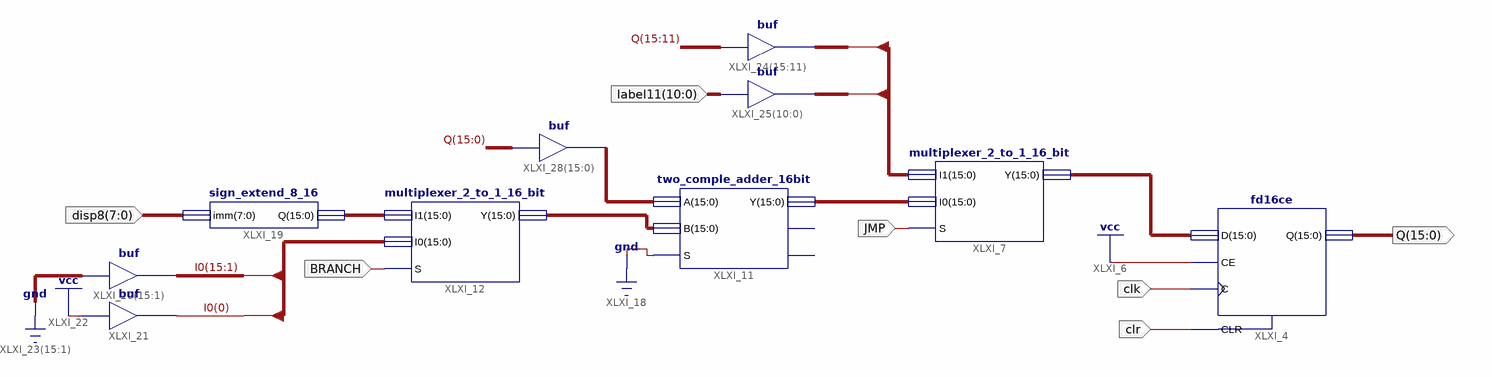
[diagram p0: schematic sheet 1]
// Xilinx ISE schematic PC_circuitry.sch (virtex6) as structural Verilog: 10 symbols, 7 ports
module PC_circuitry (
  input  clk,
  input  clr,
  input  JMP,
  input  BRANCH,
  input  [7:0] disp8,
  input  [10:0] label11,
  output [15:0] Q
);

  wire [15:0] I0, I1, XLXN_4, XLXN_12, XLXN_22, XLXN_23, XLXN_67;

  fd16ce XLXI_4 (.C(clk), .CE(1'b1), .CLR(clr), .D(XLXN_4), .Q(Q));
  multiplexer_2_to_1_16_bit XLXI_7 (.I0(XLXN_12), .I1(I1), .S(JMP), .Y(XLXN_4));
  two_comple_adder_16bit XLXI_11 (.A(XLXN_67), .B(XLXN_22), .S(1'b0), .Y(XLXN_12));  // open: Cout, Cout_1
  multiplexer_2_to_1_16_bit XLXI_12 (.I0(I0), .I1(XLXN_23), .S(BRANCH), .Y(XLXN_22));
  sign_extend_8_16 XLXI_19 (.imm(disp8), .Q(XLXN_23));
  assign I0[15:1] = {15{1'b0}};  // buf XLXI_20[15..1], 15 bits wide
  buf XLXI_21 (I0[0], 1'b1);
  assign I1[15:11] = Q[15:11];  // buf XLXI_24[15..11], 5 bits wide
  assign I1[10:0] = label11;  // buf XLXI_25[10..0], 11 bits wide
  assign XLXN_67 = Q;  // buf XLXI_28[15..0], 16 bits wide
endmodule
